# EasyEDA schematic PCB_Actualizada_AMR.json
TITLE: Sheet_1; REV: 1.0; Date: 2026-02-04; Sheet: 1/1; Drawn By: a01736216; Company: Your Company
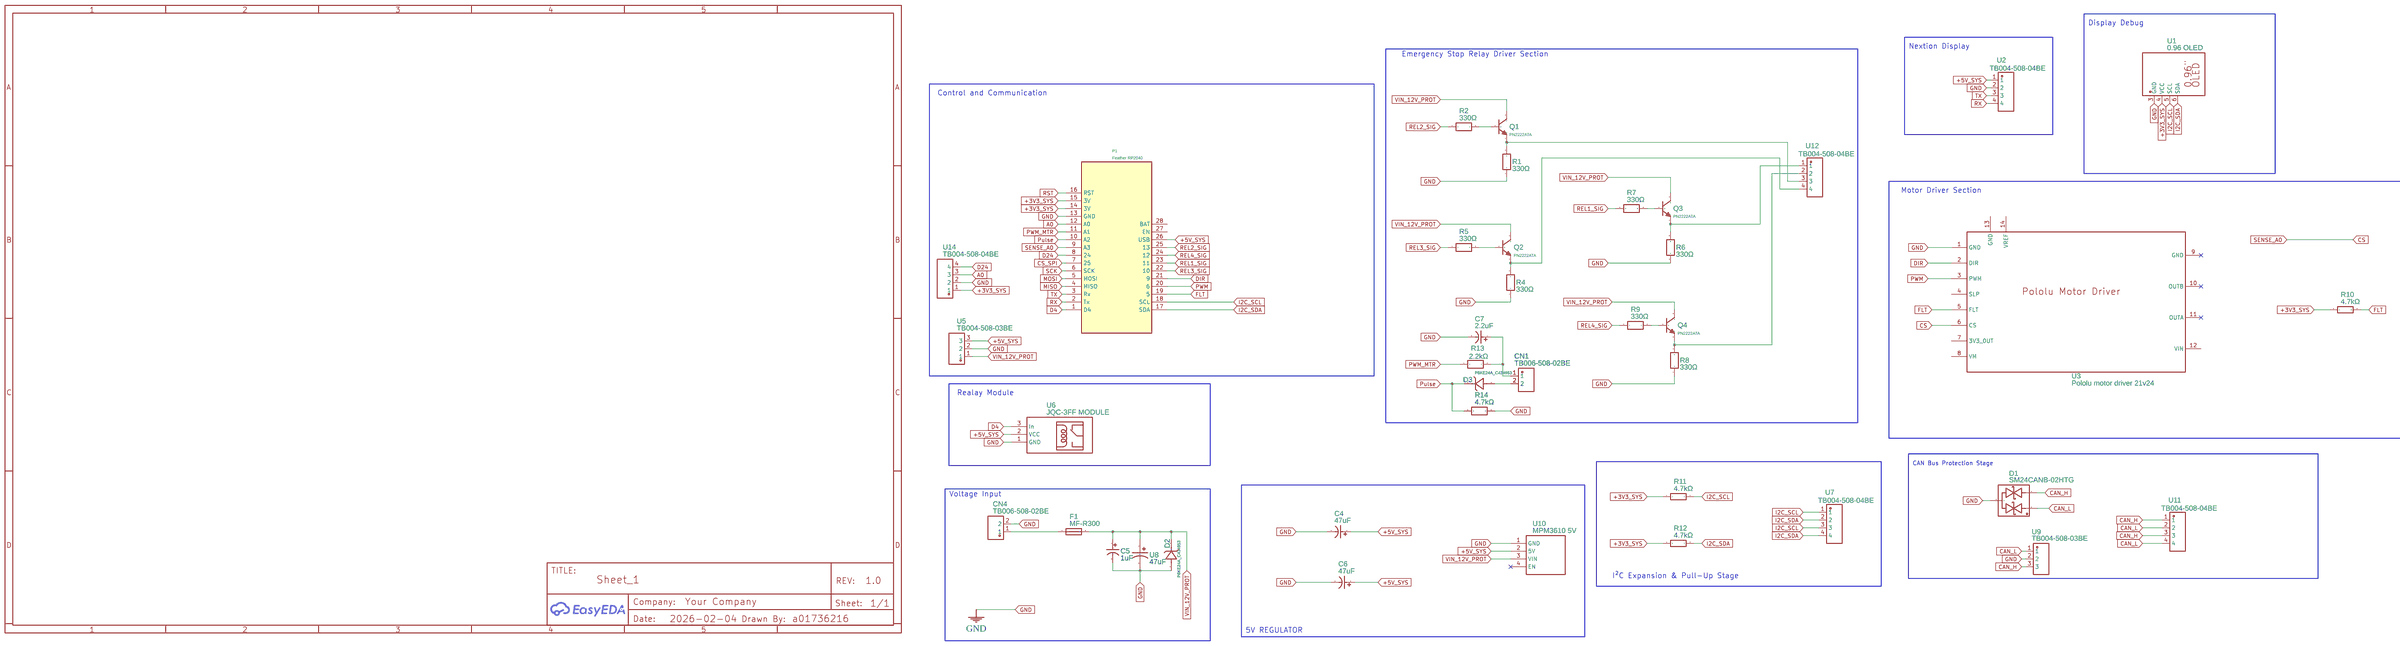
[diagram p0: schematic sheet]

## Parts
C4  47uF  [CAP-TH_BD5.0-P2.00-D0.8-FD]
C5  1uF  [CAP-TH_BD6.3-P2.50-D1.0-FD]
C6  47uF  [CAP-TH_BD5.0-P2.00-D0.8-FD]
C7  2.2uF  [CAP-TH_BD5.0-P2.00-D0.8-FD]
CN1  TB006-508-02BE  [CONN-TH_2P-P5.08]
CN4  TB006-508-02BE  [CONN-TH_2P-P5.08]
D1  SM24CANB-02HTG  [SOT-23-3_L2.9-W1.3-P1.90-LS2.4-BR]
D2  P6KE24A_C434953  [DO-15_BD3.1-L6.7-P10.70-D0.9-RD]
D3  P6KE24A_C434953  [DO-15_BD3.1-L6.7-P10.70-D0.9-RD]
F1  MF-R300  [FUSE-TH_L12.8-W3.0-P5.80-D1.2-S2.20]
P1  Feather RP2040  [FEATHER RP2040_SINHOLELS]
Q1  PN2222ATA  [TO-92-3_L4.9-W3.7-P2.54-L]
Q2  PN2222ATA  [TO-92-3_L4.9-W3.7-P2.54-L]
Q3  PN2222ATA  [TO-92-3_L4.9-W3.7-P2.54-L]
Q4  PN2222ATA  [TO-92-3_L4.9-W3.7-P2.54-L]
R1  330Ω  [RES-TH_BD2.4-L6.3-P10.30-D0.6]
R2  330Ω  [RES-TH_BD2.4-L6.3-P10.30-D0.6]
R4  330Ω  [RES-TH_BD2.4-L6.3-P10.30-D0.6]
R5  330Ω  [RES-TH_BD2.4-L6.3-P10.30-D0.6]
R6  330Ω  [RES-TH_BD2.4-L6.3-P10.30-D0.6]
R7  330Ω  [RES-TH_BD2.4-L6.3-P10.30-D0.6]
R8  330Ω  [RES-TH_BD2.4-L6.3-P10.30-D0.6]
R9  330Ω  [RES-TH_BD2.4-L6.3-P10.30-D0.6]
R10  4.7kΩ  [RES-TH_BD2.3-L6.5-P10.50-D0.5]
R11  4.7kΩ  [RES-TH_BD2.3-L6.5-P10.50-D0.5]
R12  4.7kΩ  [RES-TH_BD2.3-L6.5-P10.50-D0.5]
R13  2.2kΩ  [RES-TH_BD2.4-L6.3-P10.30-D0.6]
R14  4.7kΩ  [RES-TH_BD2.4-L6.3-P10.30-D0.6]
U1  0.96 OLED  [OLED-TH_OLED0.96-I2C]
U2  TB004-508-04BE  [CONN-TH_4P-P5.08_TB004-508-04BE]
U3  Pololu motor driver 21v24  [POLOLU MOTOR DRIVER_24_24_SINHOLESV1]
U5  TB004-508-03BE  [CONN-TH_3P-P5.08_TB004-508-03BE]
U6  JQC-3FF MODULE  [JQC-3FF-S-Z MODULE]
U7  TB004-508-04BE  [CONN-TH_4P-P5.08_TB004-508-04BE]
U8  47uF  [CAP-TH_BD5.0-P2.00-D0.5-FD]
U9  TB004-508-03BE  [CONN-TH_3P-P5.08_TB004-508-03BE]
U10  MPM3610 5V  [MPM3610_SINHOLES]
U11  TB004-508-04BE  [CONN-TH_4P-P5.08_TB004-508-04BE]
U12  TB004-508-04BE  [CONN-TH_4P-P5.08_TB004-508-04BE]
U14  TB004-508-04BE  [CONN-TH_4P-P5.08_TB004-508-04BE]

## Library data of the parts
C4 C6 C7 = 47uF 16V Aluminum electrolytic capacitors: Supplier: LCSC; Manufacturer: Chengx(承兴); Manufacturer Part: KM476M016D11RR0VH2FP0; Supplier Part: C22320; JLCPCB Part Class: Extended Part
C5 = 1uF 250V 6.3*11: Supplier: LCSC; Manufacturer: Chengx(承兴); Manufacturer Part: KM105M250E11RR0VH2FP0; Supplier Part: C46084; JLCPCB Part Class: Extended Part
CN1 CN4 = TB006-508-02BE: Contributor: lcsc; Supplier: LCSC; Supplier Part: C9900020622; Manufacturer: null; JLCPCB Part Class: Extended Part
D1 = SM24CANB-02HTG: Contributor: LCSC; Supplier: LCSC; Supplier Part: C151237; Manufacturer: Littelfuse(美国力特); JLCPCB Part Class: Extended Part
D2 D3 = P6KE24A_C434953: Contributor: LCSC; Supplier: LCSC; Supplier Part: C434953; Manufacturer: CREATEK(达晶微); Manufacturer Part: P6KE24A; JLCPCB Part Class: Extended Part
F1 = MF-R300: Contributor: LCSC; Supplier: LCSC; Supplier Part: C208487; Manufacturer: BOURNS; JLCPCB Part Class: Extended Part
P1 = Feather RP2040: sourceId: 1T5FDZYC8; Manufacturer: Adafruit; link: https://learn.adafruit.com/adafruit-feather-rp2040-pico; Contributor: JVSI
Q1-Q4 = PN2222ATA: Contributor: LCSC; Supplier: LCSC; Supplier Part: C903217; Manufacturer: onsemi(安森美); JLCPCB Part Class: Extended Part
R1 R2 R4-R9 R13 R14 = RN 1/4W 330R F T/B A1: Contributor: LCSC; Supplier: LCSC; Supplier Part: C410632; Manufacturer: Tyohm(幸亚电阻); JLCPCB Part Class: Extended Part
R10-R12 = CF1/4W-4.7KΩ±5% T52: Contributor: LCSC; Supplier: LCSC; Supplier Part: C120071; Manufacturer: CCO(千志电子); Manufacturer Part: CF1/4W-4.7KΩ±5% T; JLCPCB Part Class: Extended Part
U1 = 0.96 OLED: Supplier Part: AZDelivery; Manufacturer: AZDelivery; Manufacturer Part: ZJY096S0700BG01蓝色; link: https://img.jlc.com/pdf/applyPasteComponent/2022-08-15/203417A/337c2d88c1b34c958220578f8c1ccd46/ZJY096S0700WG01.pdf; Contributor: thihan
U2 U7 U11 U12 U14 = TB004-508-04BE: Supplier: LCSC; Supplier Part: C6547298; Manufacturer: CUI; JLCPCB Part Class: Extended Part; Contributor: lcsc
U3 = Pololu motor driver 18v25: Contributor: alejandroeliasg; Package Display: No
U5 U9 = TB004-508-03BE: Supplier: LCSC; Supplier Part: C7397073; Manufacturer: CUI; JLCPCB Part Class: Extended Part; Contributor: lcsc
U6 = JQC-3FF MODULE: Manufacturer Part: JQC-3FF; Contributor: ADARSHA_NARAYAN_MALLICK
U8 = 25V47UF CD110: Contributor: lcsc; Supplier: LCSC; Supplier Part: C2960371; Manufacturer: HRK(鸿瑞凯电子); Manufacturer Part: 25V47uF CD110; JLCPCB Part Class: Extended Part
U10 = MPM3610 5V: Manufacturer: Adafruit; Manufacturer Part: 4739; link: https://www.adafruit.com/product/4739#description; Contributor: a00838034; Package Display: No

## Nets
+3V3_SYS: P1.14(3V) P1.15(3V) R10.1 R11.1 R12.1 U1.4(VCC) U14.1
+5V_SYS: C4.1 C6.1 P1.26(USB) U2.1 U5.3 U6.2(VCC) U10.2(5V)
GND: C4.2 C5.2 C6.2 C7.2 CN4.2 D1.3 D2.2(A) P1.13(GND) R1.1 R4.1 R6.1 R8.1 R14.2 U1.3(GND) U2.2 U3.1(GND) U5.2 U6.1(GND) U8.2 U9.2 U10.1(GND) U14.2
VIN_12V_PROT: C5.1 D2.1(C) F1.2 Q1.3(C) Q2.3(C) Q3.3(C) Q4.3(C) U5.1 U8.1 U10.3(VIN)
A0: P1.12(A0) U14.3
CAN_H: D1.2 U9.3 U11.1 U11.3
CAN_L: D1.1 U9.1 U11.2 U11.4
CS: P1.9(A3) U3.6(CS)
CS_SPI: P1.7(25)
D4: P1.1(D4) U6.3(In)
D24: P1.8(24) U14.4
DIR: P1.21(9) U3.2(DIR)
FLT: P1.19(5) R10.2 U3.5(FLT)
I2C_SCL: P1.18(SCL) R11.2 U1.5(SCL) U7.1 U7.3
I2C_SDA: P1.17(SDA) R12.2 U1.6(SDA) U7.2 U7.4
MISO: P1.4(MISO)
MOSI: P1.5(MOSI)
Pulse: D3.1(C) P1.10(A2) R14.1
PWM: P1.20(6) U3.3(PWM)
PWM_MTR: P1.11(A1) R13.1
REL1_SIG: P1.23(11) R7.1
REL2_SIG: P1.25(13) R2.1
REL3_SIG: P1.22(10) R5.1
REL4_SIG: P1.24(12) R9.1
RST: P1.16(RST)
RX: P1.2(Tx) U2.4
SCK: P1.6(SCK)
TX: P1.3(Rx) U2.3
Net-(C7-1): C7.1 CN1.1 R13.2
Net-(CN1-2): CN1.2 D3.2(A)
Net-(CN4-1): CN4.1 F1.1
Net-(Q1-1): Q1.1(E) R1.2 U12.3
Net-(Q1-2): Q1.2(B) R2.2
Net-(Q2-1): Q2.1(E) R4.2 U12.4
Net-(Q2-2): Q2.2(B) R5.2
Net-(Q3-1): Q3.1(E) R6.2 U12.1
Net-(Q3-2): Q3.2(B) R7.2
Net-(Q4-1): Q4.1(E) R8.2 U12.2
Net-(Q4-2): Q4.2(B) R9.2

Not connected (* = marked no-connect by the designer): P1 27(EN) 28(BAT); U3 4(SLP) 7(3V3 0UT) 8(VM) 9(GND)* 10(OUTB)* 11(OUTA)* 12(VIN) 13(GND) 14(VREF); U10 4(EN)*

## Notes on the sheet
- Display Debug
- Nextion Display
- Emergency Stop Relay Driver Section
- Control and Communication
- Motor Driver Section
- Realay Module
- CAN Bus Protection Stage
- Voltage Input
- I²C Expansion & Pull-Up Stage
- 5V REGULATOR
